# EAGLE schematic 7219_32_16 (EAGLE 7.7.0)

## Sheet 1 of 4
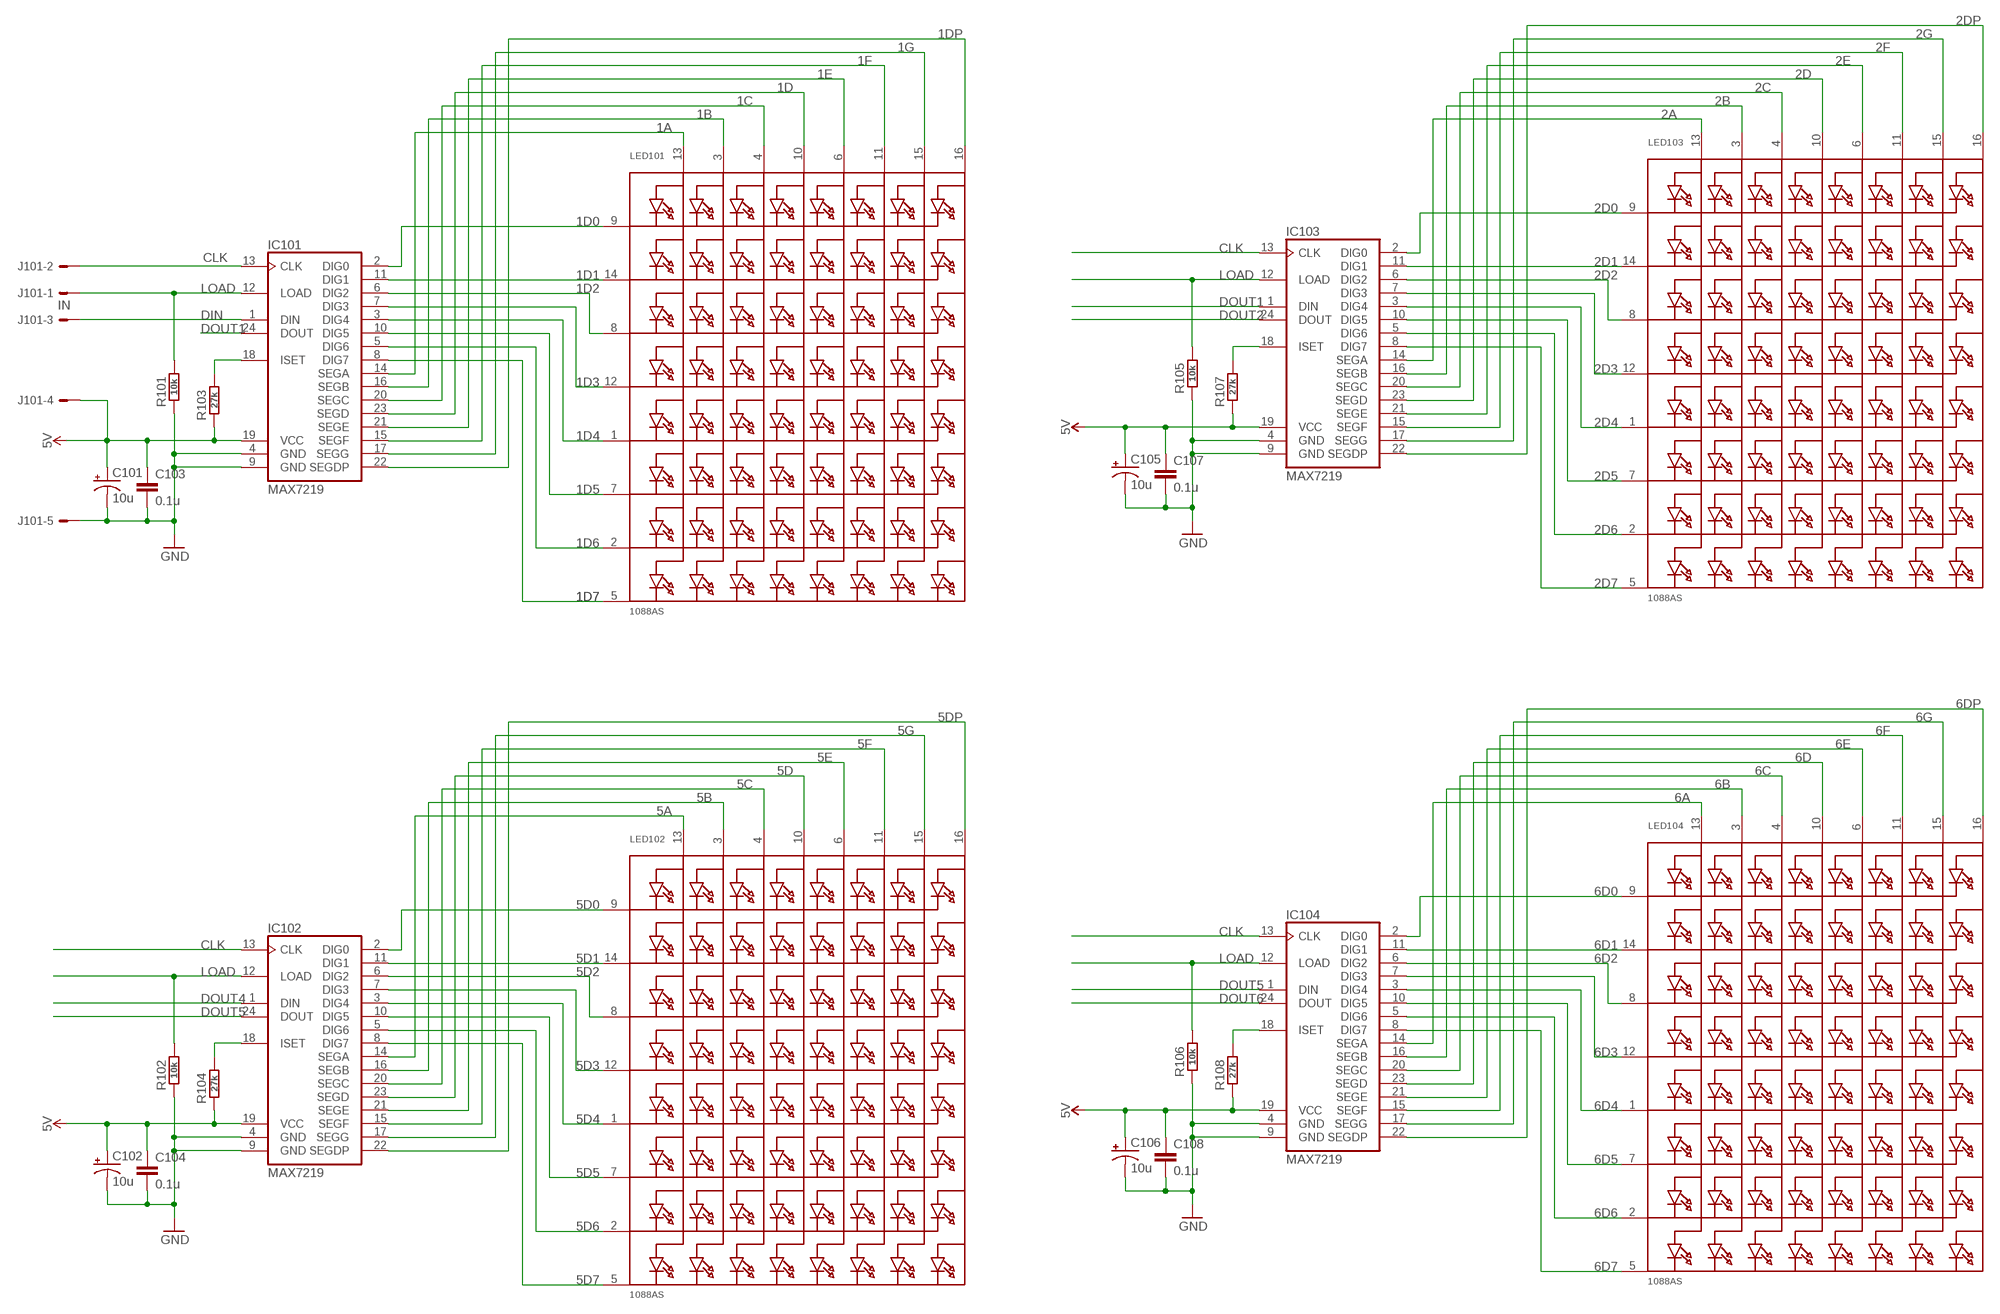
[diagram p0: schematic, sheet 1, part 1 of 2]
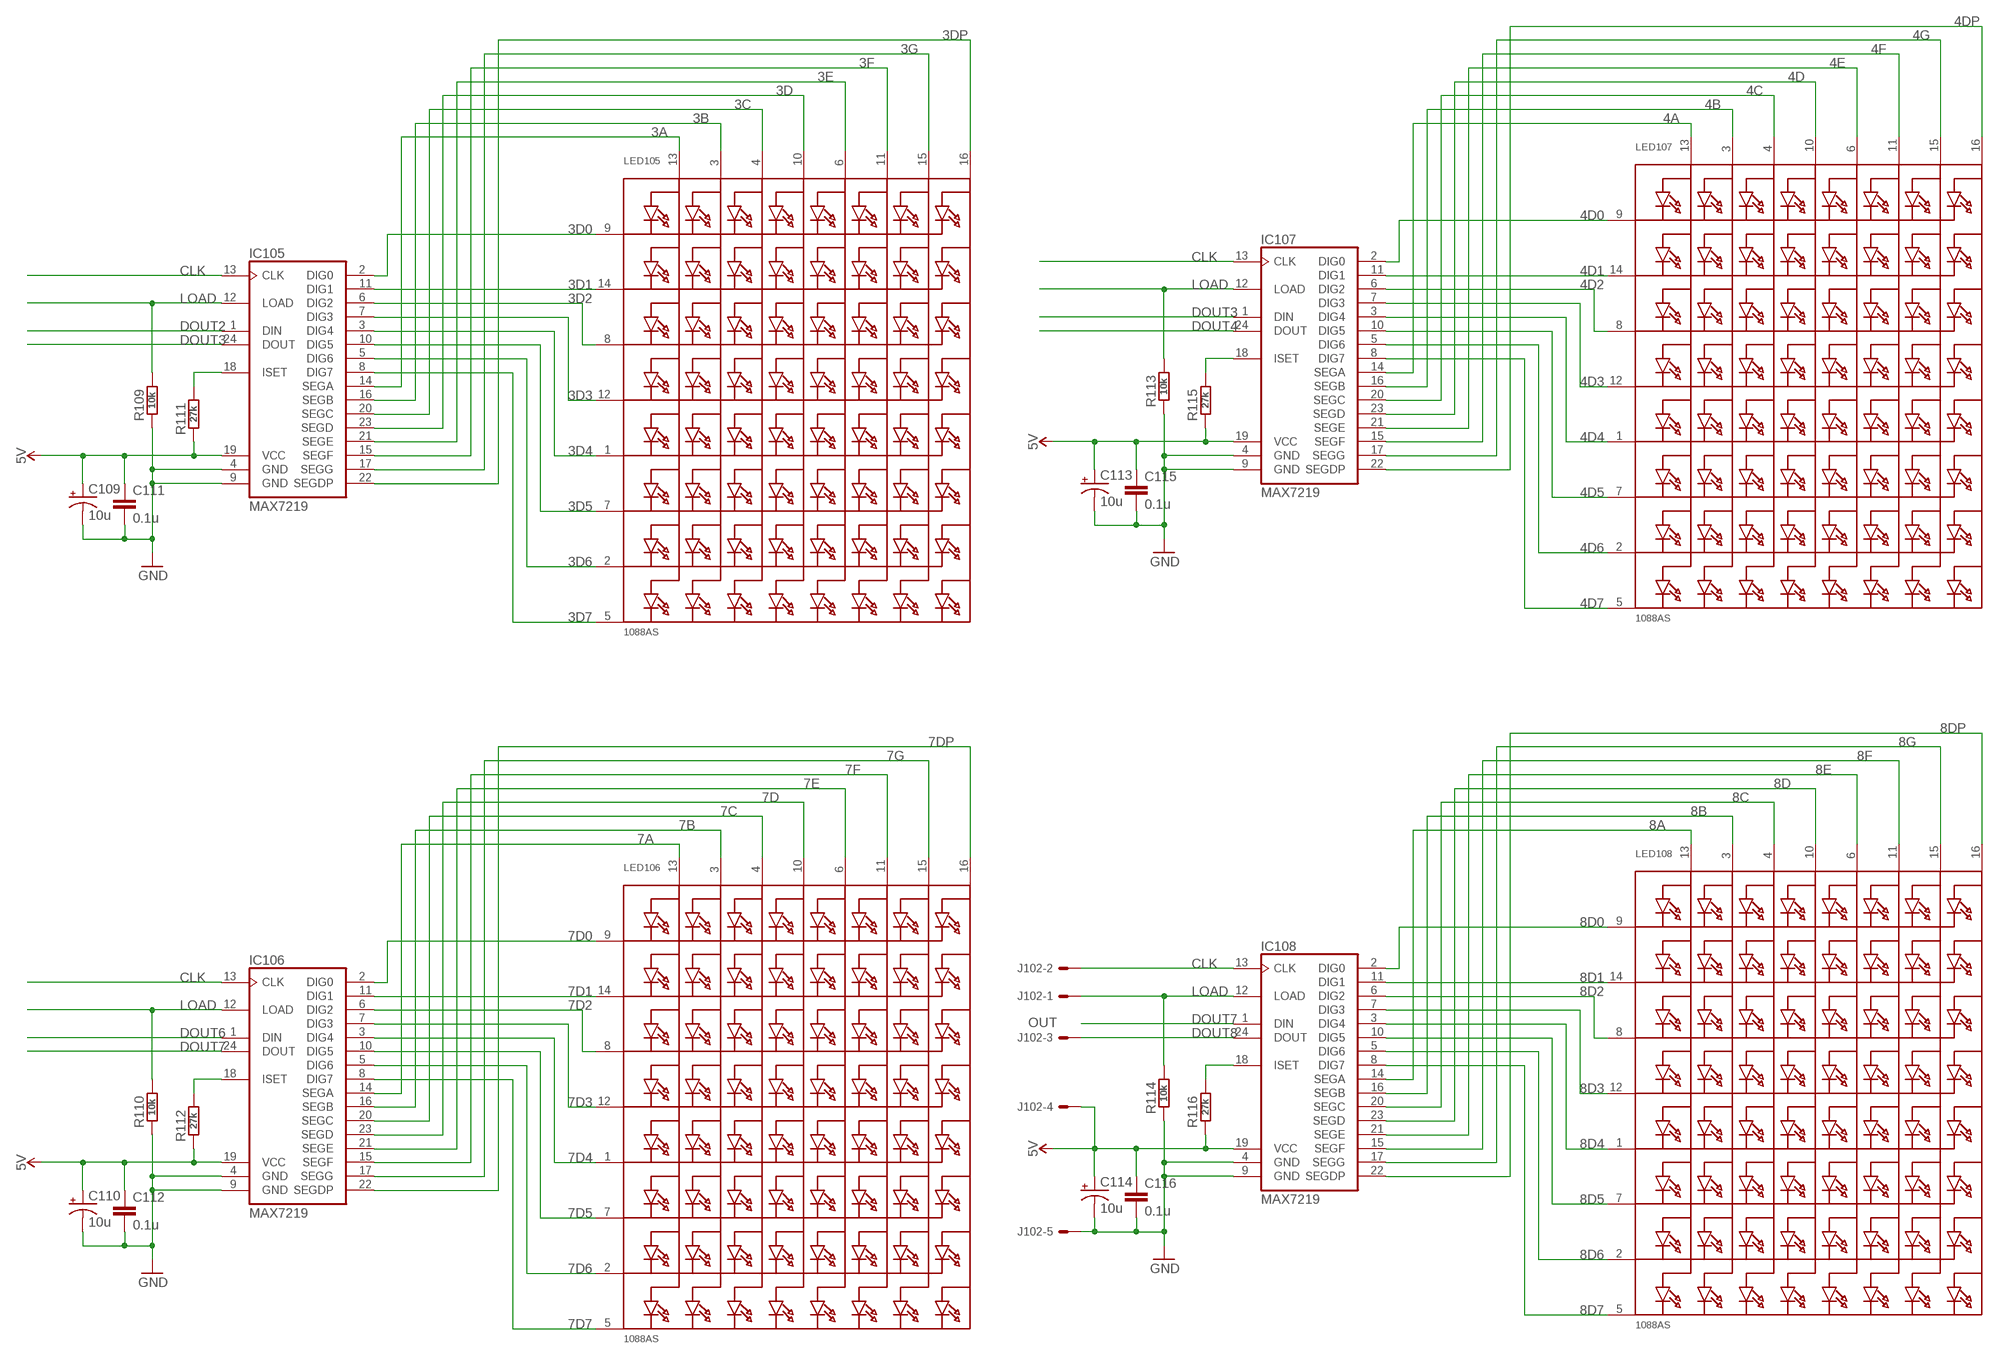
[diagram p1: schematic, sheet 1, part 2 of 2]

### Parts
C101  10u  CAP_POL1206  [EIA3216]
C102  10u  CAP_POL1206  [EIA3216]
C103  0.1u  CAP0603-CAP  [0603-CAP]
C104  0.1u  CAP0603-CAP  [0603-CAP]
C105  10u  CAP_POL1206  [EIA3216]
C106  10u  CAP_POL1206  [EIA3216]
C107  0.1u  CAP0603-CAP  [0603-CAP]
C108  0.1u  CAP0603-CAP  [0603-CAP]
C109  10u  CAP_POL1206  [EIA3216]
C110  10u  CAP_POL1206  [EIA3216]
C111  0.1u  CAP0603-CAP  [0603-CAP]
C112  0.1u  CAP0603-CAP  [0603-CAP]
C113  10u  CAP_POL1206  [EIA3216]
C114  10u  CAP_POL1206  [EIA3216]
C115  0.1u  CAP0603-CAP  [0603-CAP]
C116  0.1u  CAP0603-CAP  [0603-CAP]
IC101  MAX7219  MAX7219CNGSO24  [SO24L]
IC102  MAX7219  MAX7219CNGSO24  [SO24L]
IC103  MAX7219  MAX7219CNGSO24  [SO24L]
IC104  MAX7219  MAX7219CNGSO24  [SO24L]
IC105  MAX7219  MAX7219CNGSO24  [SO24L]
IC106  MAX7219  MAX7219CNGSO24  [SO24L]
IC107  MAX7219  MAX7219CNGSO24  [SO24L]
IC108  MAX7219  MAX7219CNGSO24  [SO24L]
J101  IN  C-GRID-05-70543  [70543-05]
J102  OUT  C-GRID-05-70543  [70543-05]
LED101  1088AS  DISP_SEGMENT_8X8_ROWCATHODEM12A881UR  [SEGMENT_BL-M12A881UR]
LED102  1088AS  DISP_SEGMENT_8X8_ROWCATHODEM12A881UR  [SEGMENT_BL-M12A881UR]
LED103  1088AS  DISP_SEGMENT_8X8_ROWCATHODEM12A881UR  [SEGMENT_BL-M12A881UR]
LED104  1088AS  DISP_SEGMENT_8X8_ROWCATHODEM12A881UR  [SEGMENT_BL-M12A881UR]
LED105  1088AS  DISP_SEGMENT_8X8_ROWCATHODEM12A881UR  [SEGMENT_BL-M12A881UR]
LED106  1088AS  DISP_SEGMENT_8X8_ROWCATHODEM12A881UR  [SEGMENT_BL-M12A881UR]
LED107  1088AS  DISP_SEGMENT_8X8_ROWCATHODEM12A881UR  [SEGMENT_BL-M12A881UR]
LED108  1088AS  DISP_SEGMENT_8X8_ROWCATHODEM12A881UR  [SEGMENT_BL-M12A881UR]
R101  10k  R-EU_R0603  [R0603]
R102  10k  R-EU_R0603  [R0603]
R103  27k  R-EU_R0603  [R0603]
R104  27k  R-EU_R0603  [R0603]
R105  10k  R-EU_R0603  [R0603]
R106  10k  R-EU_R0603  [R0603]
R107  27k  R-EU_R0603  [R0603]
R108  27k  R-EU_R0603  [R0603]
R109  10k  R-EU_R0603  [R0603]
R110  10k  R-EU_R0603  [R0603]
R111  27k  R-EU_R0603  [R0603]
R112  27k  R-EU_R0603  [R0603]
R113  10k  R-EU_R0603  [R0603]
R114  10k  R-EU_R0603  [R0603]
R115  27k  R-EU_R0603  [R0603]
R116  27k  R-EU_R0603  [R0603]

### Nets
1A: IC101.14(SEGA) LED101.13(A1)
1B: IC101.16(SEGB) LED101.3(A2)
1C: IC101.20(SEGC) LED101.4(A3)
1D: IC101.23(SEGD) LED101.10(A4)
1D0: IC101.2(DIG0) LED101.9(K1)
1D1: IC101.11(DIG1) LED101.14(K2)
1D2: IC101.6(DIG2) LED101.8(K3)
1D3: IC101.7(DIG3) LED101.12(K4)
1D4: IC101.3(DIG4) LED101.1(K5)
1D5: IC101.10(DIG5) LED101.7(K6)
1D6: IC101.5(DIG6) LED101.2(K7)
1D7: IC101.8(DIG7) LED101.5(K8)
1DP: IC101.22(SEGDP) LED101.16(A8)
1E: IC101.21(SEGE) LED101.6(A5)
1F: IC101.15(SEGF) LED101.11(A6)
1G: IC101.17(SEGG) LED101.15(A7)
2A: IC103.14(SEGA) LED103.13(A1)
2B: IC103.16(SEGB) LED103.3(A2)
2C: IC103.20(SEGC) LED103.4(A3)
2D: IC103.23(SEGD) LED103.10(A4)
2D0: IC103.2(DIG0) LED103.9(K1)
2D1: IC103.11(DIG1) LED103.14(K2)
2D2: IC103.6(DIG2) LED103.8(K3)
2D3: IC103.7(DIG3) LED103.12(K4)
2D4: IC103.3(DIG4) LED103.1(K5)
2D5: IC103.10(DIG5) LED103.7(K6)
2D6: IC103.5(DIG6) LED103.2(K7)
2D7: IC103.8(DIG7) LED103.5(K8)
2DP: IC103.22(SEGDP) LED103.16(A8)
2E: IC103.21(SEGE) LED103.6(A5)
2F: IC103.15(SEGF) LED103.11(A6)
2G: IC103.17(SEGG) LED103.15(A7)
3A: IC105.14(SEGA) LED105.13(A1)
3B: IC105.16(SEGB) LED105.3(A2)
3C: IC105.20(SEGC) LED105.4(A3)
3D: IC105.23(SEGD) LED105.10(A4)
3D0: IC105.2(DIG0) LED105.9(K1)
3D1: IC105.11(DIG1) LED105.14(K2)
3D2: IC105.6(DIG2) LED105.8(K3)
3D3: IC105.7(DIG3) LED105.12(K4)
3D4: IC105.3(DIG4) LED105.1(K5)
3D5: IC105.10(DIG5) LED105.7(K6)
3D6: IC105.5(DIG6) LED105.2(K7)
3D7: IC105.8(DIG7) LED105.5(K8)
3DP: IC105.22(SEGDP) LED105.16(A8)
3E: IC105.21(SEGE) LED105.6(A5)
3F: IC105.15(SEGF) LED105.11(A6)
3G: IC105.17(SEGG) LED105.15(A7)
4A: IC107.14(SEGA) LED107.13(A1)
4B: IC107.16(SEGB) LED107.3(A2)
4C: IC107.20(SEGC) LED107.4(A3)
4D: IC107.23(SEGD) LED107.10(A4)
4D0: IC107.2(DIG0) LED107.9(K1)
4D1: IC107.11(DIG1) LED107.14(K2)
4D2: IC107.6(DIG2) LED107.8(K3)
4D3: IC107.7(DIG3) LED107.12(K4)
4D4: IC107.3(DIG4) LED107.1(K5)
4D5: IC107.10(DIG5) LED107.7(K6)
4D6: IC107.5(DIG6) LED107.2(K7)
4D7: IC107.8(DIG7) LED107.5(K8)
4DP: IC107.22(SEGDP) LED107.16(A8)
4E: IC107.21(SEGE) LED107.6(A5)
4F: IC107.15(SEGF) LED107.11(A6)
4G: IC107.17(SEGG) LED107.15(A7)
5A: IC102.14(SEGA) LED102.13(A1)
5B: IC102.16(SEGB) LED102.3(A2)
5C: IC102.20(SEGC) LED102.4(A3)
5D: IC102.23(SEGD) LED102.10(A4)
5D0: IC102.2(DIG0) LED102.9(K1)
5D1: IC102.11(DIG1) LED102.14(K2)
5D2: IC102.6(DIG2) LED102.8(K3)
5D3: IC102.7(DIG3) LED102.12(K4)
5D4: IC102.3(DIG4) LED102.1(K5)
5D5: IC102.10(DIG5) LED102.7(K6)
5D6: IC102.5(DIG6) LED102.2(K7)
5D7: IC102.8(DIG7) LED102.5(K8)
5DP: IC102.22(SEGDP) LED102.16(A8)
5E: IC102.21(SEGE) LED102.6(A5)
5F: IC102.15(SEGF) LED102.11(A6)
5G: IC102.17(SEGG) LED102.15(A7)
6A: IC104.14(SEGA) LED104.13(A1)
6B: IC104.16(SEGB) LED104.3(A2)
6C: IC104.20(SEGC) LED104.4(A3)
6D: IC104.23(SEGD) LED104.10(A4)
6D0: IC104.2(DIG0) LED104.9(K1)
6D1: IC104.11(DIG1) LED104.14(K2)
6D2: IC104.6(DIG2) LED104.8(K3)
6D3: IC104.7(DIG3) LED104.12(K4)
6D4: IC104.3(DIG4) LED104.1(K5)
6D5: IC104.10(DIG5) LED104.7(K6)
6D6: IC104.5(DIG6) LED104.2(K7)
6D7: IC104.8(DIG7) LED104.5(K8)
6DP: IC104.22(SEGDP) LED104.16(A8)
6E: IC104.21(SEGE) LED104.6(A5)
6F: IC104.15(SEGF) LED104.11(A6)
6G: IC104.17(SEGG) LED104.15(A7)
7A: IC106.14(SEGA) LED106.13(A1)
7B: IC106.16(SEGB) LED106.3(A2)
7C: IC106.20(SEGC) LED106.4(A3)
7D: IC106.23(SEGD) LED106.10(A4)
7D0: IC106.2(DIG0) LED106.9(K1)
7D1: IC106.11(DIG1) LED106.14(K2)
7D2: IC106.6(DIG2) LED106.8(K3)
7D3: IC106.7(DIG3) LED106.12(K4)
7D4: IC106.3(DIG4) LED106.1(K5)
7D5: IC106.10(DIG5) LED106.7(K6)
7D6: IC106.5(DIG6) LED106.2(K7)
7D7: IC106.8(DIG7) LED106.5(K8)
7DP: IC106.22(SEGDP) LED106.16(A8)
7E: IC106.21(SEGE) LED106.6(A5)
7F: IC106.15(SEGF) LED106.11(A6)
7G: IC106.17(SEGG) LED106.15(A7)
8A: IC108.14(SEGA) LED108.13(A1)
8B: IC108.16(SEGB) LED108.3(A2)
8C: IC108.20(SEGC) LED108.4(A3)
8D: IC108.23(SEGD) LED108.10(A4)
8D0: IC108.2(DIG0) LED108.9(K1)
8D1: IC108.11(DIG1) LED108.14(K2)
8D2: IC108.6(DIG2) LED108.8(K3)
8D3: IC108.7(DIG3) LED108.12(K4)
8D4: IC108.3(DIG4) LED108.1(K5)
8D5: IC108.10(DIG5) LED108.7(K6)
8D6: IC108.5(DIG6) LED108.2(K7)
8D7: IC108.8(DIG7) LED108.5(K8)
8DP: IC108.22(SEGDP) LED108.16(A8)
8E: IC108.21(SEGE) LED108.6(A5)
8F: IC108.15(SEGF) LED108.11(A6)
8G: IC108.17(SEGG) LED108.15(A7)
+5V: C101.A(+) C102.A(+) C103.1 C104.1 C105.A(+) C106.A(+) C107.1 C108.1 C109.A(+) C110.A(+) C111.1 C112.1 C113.A(+) C114.A(+) C115.1 C116.1 IC101.19(VCC) IC102.19(VCC) IC103.19(VCC) IC104.19(VCC) IC105.19(VCC) IC106.19(VCC) IC107.19(VCC) IC108.19(VCC) J101.4 J102.4 R103.1 R104.1 R107.1 R108.1 R111.1 R112.1 R115.1 R116.1 ; supply symbol labelled 5V ; also sheet 2
CLK: IC101.13(CLK) IC102.13(CLK) IC103.13(CLK) IC104.13(CLK) IC105.13(CLK) IC106.13(CLK) IC107.13(CLK) IC108.13(CLK) J101.2 J102.2 ; also sheet 2,3
DIN: IC101.1(DIN) J101.3 ; also sheet 2,3
DOUT1: IC101.24(DOUT) IC103.1(DIN)
DOUT2: IC103.24(DOUT) IC105.1(DIN)
DOUT3: IC105.24(DOUT) IC107.1(DIN)
DOUT4: IC102.1(DIN) IC107.24(DOUT)
DOUT5: IC102.24(DOUT) IC104.1(DIN)
DOUT6: IC104.24(DOUT) IC106.1(DIN)
DOUT7: IC106.24(DOUT) IC108.1(DIN)
DOUT8: IC108.24(DOUT) J102.3
GND: C101.C(-) C102.C(-) C103.2 C104.2 C105.C(-) C106.C(-) C107.2 C108.2 C109.C(-) C110.C(-) C111.2 C112.2 C113.C(-) C114.C(-) C115.2 C116.2 IC101.4(GND) IC101.9(GND) IC102.4(GND) IC102.9(GND) IC103.4(GND) IC103.9(GND) IC104.4(GND) IC104.9(GND) IC105.4(GND) IC105.9(GND) IC106.4(GND) IC106.9(GND) IC107.4(GND) IC107.9(GND) IC108.4(GND) IC108.9(GND) J101.5 J102.5 R101.1 R102.1 R105.1 R106.1 R109.1 R110.1 R113.1 R114.1 ; also sheet 2,3,4
ISET1: IC101.18(ISET) R103.2
ISET2: IC103.18(ISET) R107.2
ISET3: IC105.18(ISET) R111.2
ISET4: IC107.18(ISET) R115.2
ISET5: IC102.18(ISET) R104.2
ISET6: IC104.18(ISET) R108.2
ISET7: IC106.18(ISET) R112.2
ISET8: IC108.18(ISET) R116.2
LOAD: IC101.12(LOAD) IC102.12(LOAD) IC103.12(LOAD) IC104.12(LOAD) IC105.12(LOAD) IC106.12(LOAD) IC107.12(LOAD) IC108.12(LOAD) J101.1 J102.1 R101.2 R102.2 R105.2 R106.2 R109.2 R110.2 R113.2 R114.2 ; also sheet 2,3

## Sheet 2 of 4
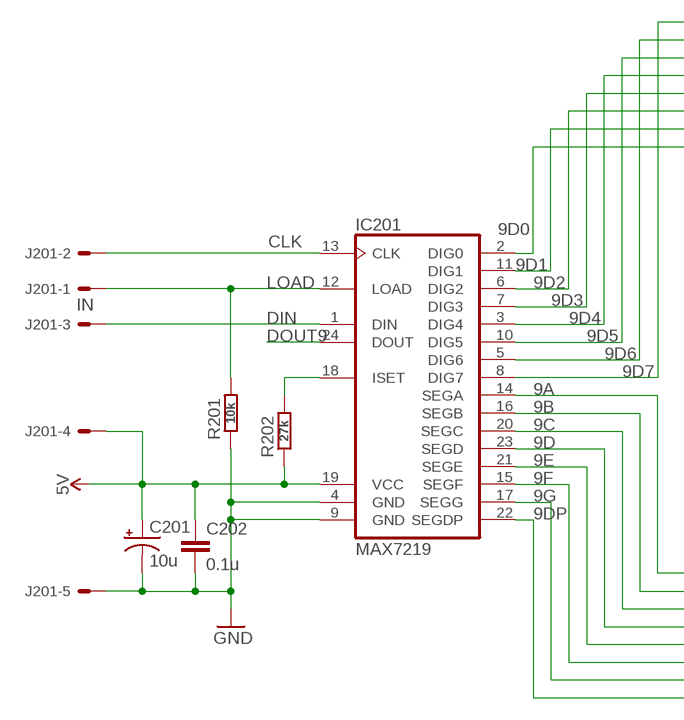
[diagram p2: schematic, sheet 2, part 1 of 2]
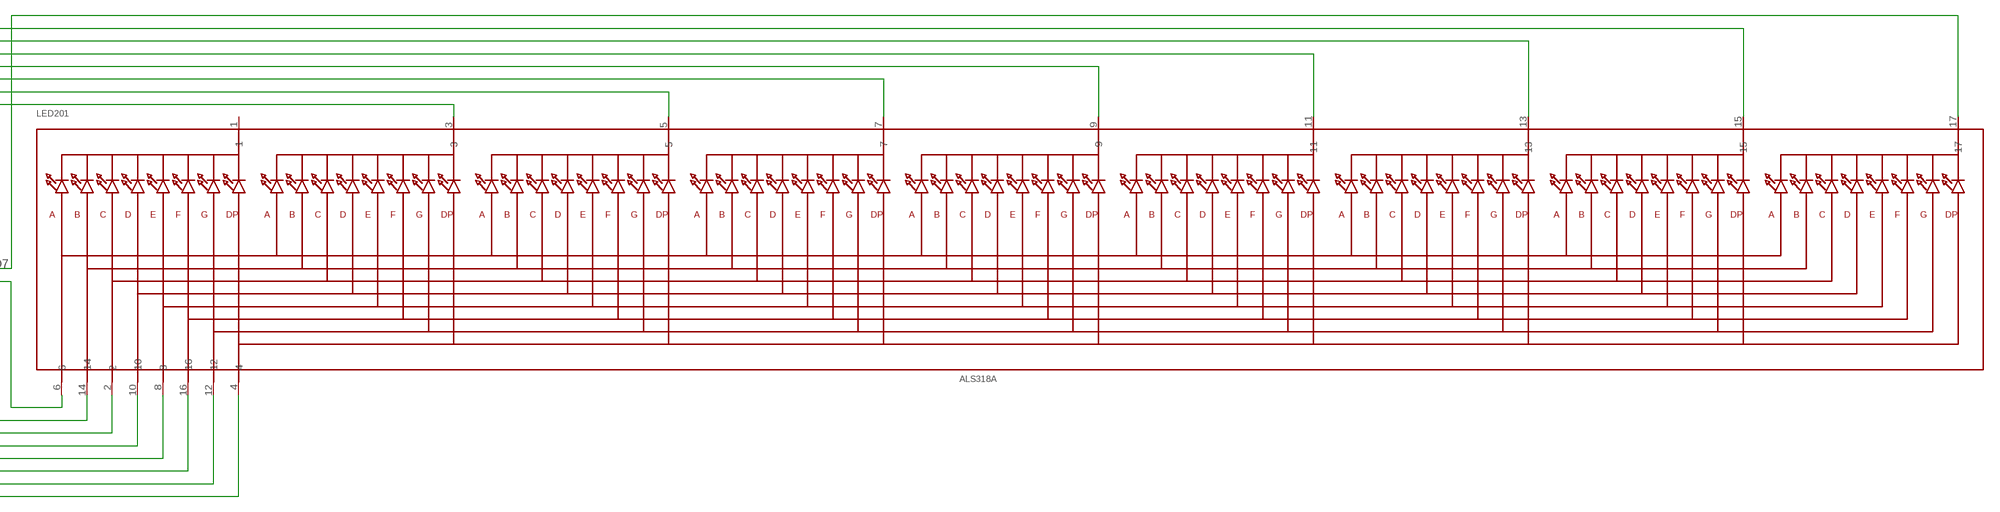
[diagram p3: schematic, sheet 2, part 2 of 2]

### Parts
C201  10u  CAP_POL1206  [EIA3216]
C202  0.1u  CAP0603-CAP  [0603-CAP]
IC201  MAX7219  MAX7219CNGSO24  [SO24L]
J201  IN  C-GRID-05-70543  [70543-05]
LED201  ALS318A  АЛС318АBASE  [АЛС318А]
R201  10k  R-EU_R0603  [R0603]
R202  27k  R-EU_R0603  [R0603]

### Nets
9A: IC201.14(SEGA) LED201.6
9B: IC201.16(SEGB) LED201.14
9C: IC201.20(SEGC) LED201.2
9D: IC201.23(SEGD) LED201.10
9D0: IC201.2(DIG0) LED201.3
9D1: IC201.11(DIG1) LED201.5
9D2: IC201.6(DIG2) LED201.7
9D3: IC201.7(DIG3) LED201.9
9D4: IC201.3(DIG4) LED201.11
9D5: IC201.10(DIG5) LED201.13
9D6: IC201.5(DIG6) LED201.15
9D7: IC201.8(DIG7) LED201.17
9DP: IC201.22(SEGDP) LED201.4
9E: IC201.21(SEGE) LED201.8
9F: IC201.15(SEGF) LED201.16
9G: IC201.17(SEGG) LED201.12
+5V: C201.A(+) C202.1 IC201.19(VCC) J201.4 R202.1 ; supply symbol labelled 5V ; also sheet 1
CLK: IC201.13(CLK) J201.2 ; also sheet 1,3
DIN: IC201.1(DIN) J201.3 ; also sheet 1,3
DOUT9: IC201.24(DOUT)
GND: C201.C(-) C202.2 IC201.4(GND) IC201.9(GND) J201.5 R201.1 ; also sheet 1,3,4
ISET9: IC201.18(ISET) R202.2
LOAD: IC201.12(LOAD) J201.1 R201.2 ; also sheet 1,3
Unconnected: LED201.1

## Sheet 3 of 4
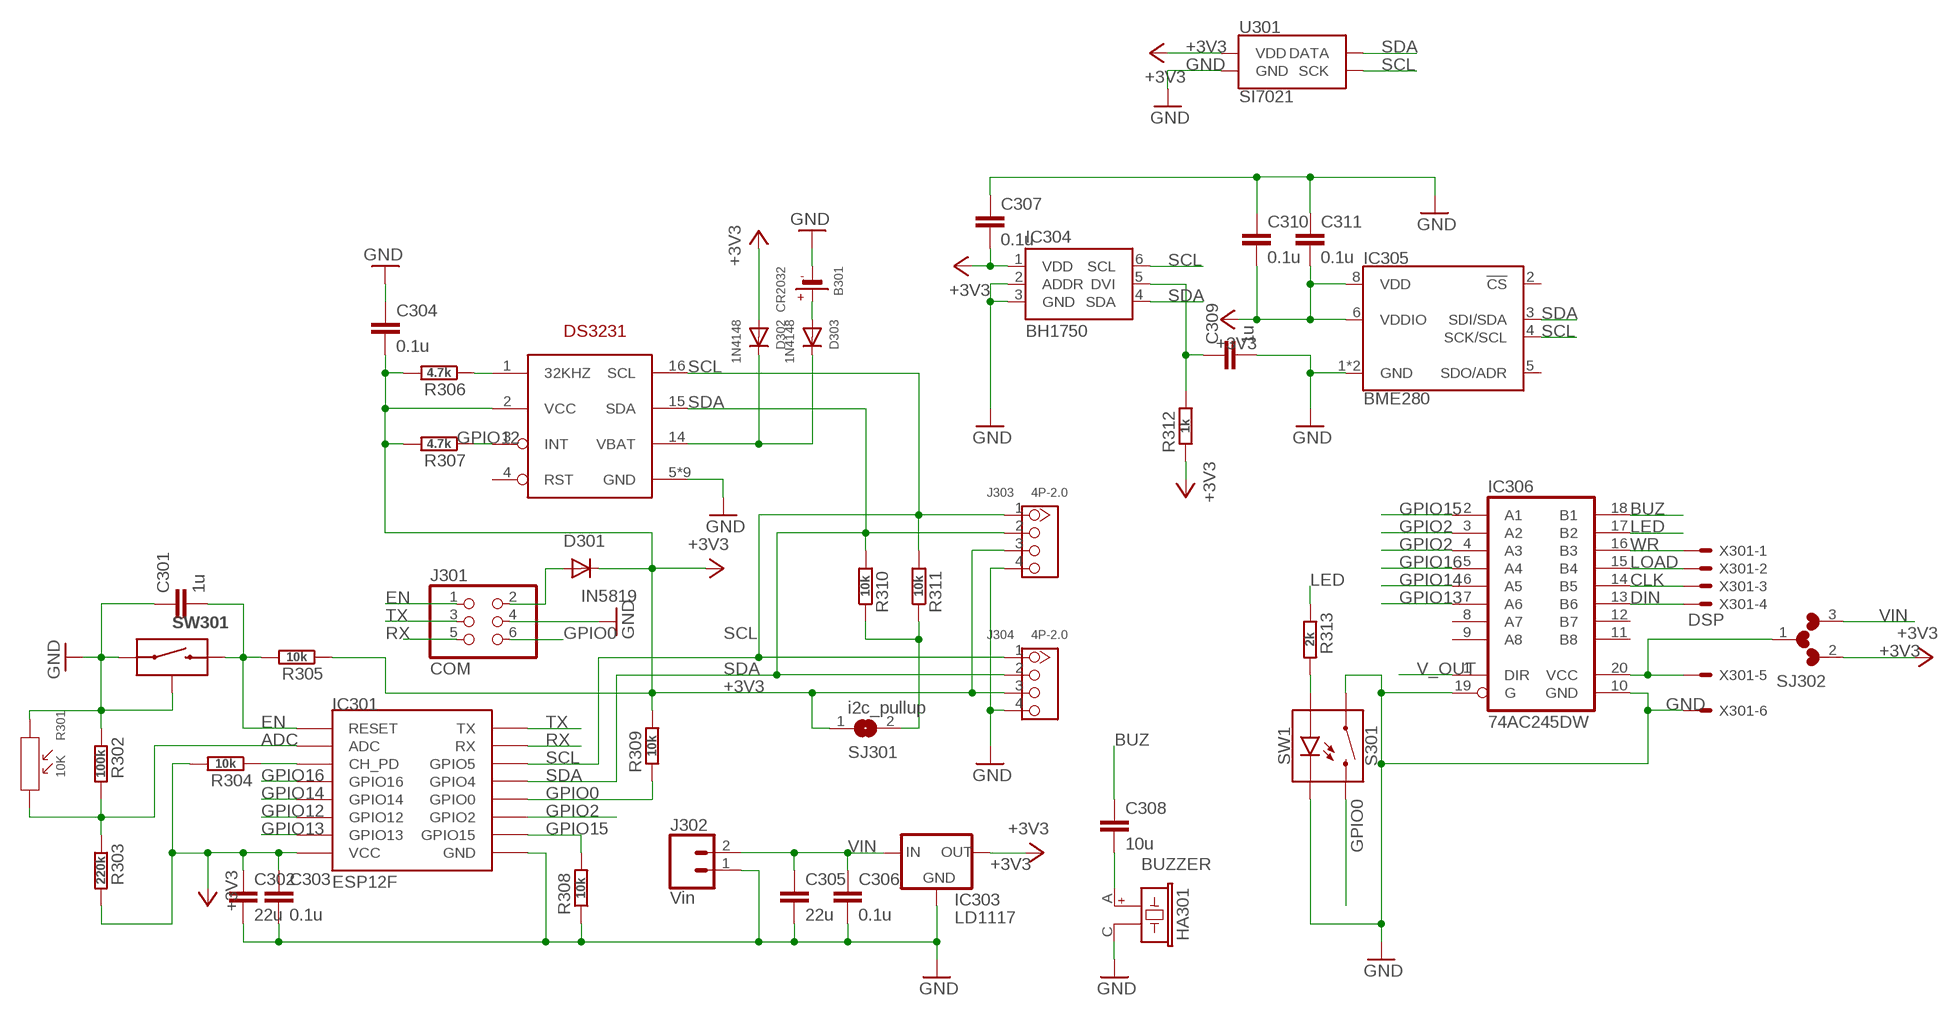
[diagram p4: schematic, sheet 3]

### Parts
B301  CR2032  BATTERYCR2032  [CR2032]
C301  1u  CAP0603-CAP  [0603-CAP]
C302  22u  CAP0603-CAP  [0603-CAP]
C303  0.1u  CAP0603-CAP  [0603-CAP]
C304  0.1u  CAP0603-CAP  [0603-CAP]
C305  22u  CAP0603-CAP  [0603-CAP]
C306  0.1u  CAP0603-CAP  [0603-CAP]
C307  0.1u  CAP0603-CAP  [0603-CAP]
C308  10u  CAP0603-CAP  [0603-CAP]
C309  1u  CAP0603-CAP  [0603-CAP]
C310  0.1u  CAP0603-CAP  [0603-CAP]
C311  0.1u  CAP0603-CAP  [0603-CAP]
D301  IN5819  DIODE-SOD123  [SOD123]
D302  1N4148  DIODESOD-323F  [SOD-323F]
D303  1N4148  DIODESOD-323F  [SOD-323F]
HA301  BUZZER  PIEZO_BUZZERHYDZ12X7.5  [PBUZ_12X7.5]
IC301  ESP12F  ESP12SMD  [ESP12-SMD]
IC302  DS3231W  [SO16W]
IC303  LD1117  V_REG_LD1117VXXSMD  [SOT223]
IC304  BH1750  [WSOF6L]
IC305  BME280  [LGA-8-2.5X2.5]
IC306  74AC245DW  [SO20W]
J301  COM  HEADER-2X3SMT_1.27  [2X03_1.27MM_SMT]
J302  Vin  CONN_02  [1X02]
J303  4P-2.0  GROVE-CONNECTOR-DIP(4P-2.0)  [HW4-2.0]
J304  4P-2.0  GROVE-CONNECTOR-DIP(4P-2.0)  [HW4-2.0]
R301  10K  PHOTORESISTOR-5528-10K(2P-5.0X4.2MM)  [SNR2-3.0]
R302  100k  R-EU_R0603  [R0603]
R303  220k  R-EU_R0603  [R0603]
R304  10k  R-EU_R0603  [R0603]
R305  10k  R-EU_R0603  [R0603]
R306  4.7k  R-EU_R0603  [R0603]
R307  4.7k  R-EU_R0603  [R0603]
R308  10k  R-EU_R0603  [R0603]
R309  10k  R-EU_R0603  [R0603]
R310  10k  R-EU_R0603  [R0603]
R311  10k  R-EU_R0603  [R0603]
R312  1k  R-EU_R0603  [R0603]
R313  2k  R-EU_R0603  [R0603]
S301  SW1  MOMENTARY-SWITCH-SPST-LED-PTH-12MM-KIT  [TACTILE_SWITCH_LED_PTH_12MM_KIT]
SJ301  i2c_pullup  MICROBUILDER_SOLDERJUMPER  [MICROBUILDER_SOLDERJUMPER_ARROW_NOPASTE]
SJ302  MICROBUILDER_SOLDERJUMPER3  [MICROBUILDER_SOLDERJUMPER_ARROW_NOPASTE_3]
SW301  RST  MICROSWITCH-BUTTON  [MICROPUSH-BUT_TOP]
U301  SI7021  [DFN-6-3X3-SI7021]
X301  DSP  C-GRID-06-70543  [70543-06]

### Nets
+3V3: C302.1 C303.1 C304.2 C307.2 C310.2 C311.2 D301.C D302.A IC301.VCC IC302.2(VCC) IC303.2(OUT) IC303.4(OUT) IC304.1(VDD) IC305.6(VDDIO) IC305.8(VDD) J303.3 J304.3 R303.2 R304.2 R305.1 R306.2 R307.2 R309.2 R312.1 SJ301.1 SJ302.2 U301.VDD ; also sheet 4
ADC: IC301.ADC R301.2 R302.2 R303.1
BUZ: C308.1 IC306.18(B1)
CLK: IC306.14(B5) X301.3 ; also sheet 1,2
DIN: IC306.13(B6) X301.4 ; also sheet 1,2
EN: C301.2 IC301.RESET J301.1 R305.2 SW301.B ; also sheet 4
GND: B301.- C301.1 C302.2 C303.2 C304.1 C305.2 C306.2 C307.1 C309.2 C310.1 C311.1 HA301.C IC301.GND IC302.5(GND) IC302.6(GND) IC302.7(GND) IC302.8(GND) IC302.9(GND) IC302.10(GND) IC302.11(GND) IC302.12(GND) IC302.13(GND) IC303.1(GND) IC304.2(ADDR) IC304.3(GND) IC305.1(GND) IC305.7(GND) IC306.10(GND) IC306.19(G) J301.4 J302.1 J303.4 J304.4 R301.1 R302.1 R308.1 S301.3 S301.4 S301.C SW301.A SW301.SH0(SH) U301.GND X301.6 ; also sheet 1,2,4
GPIO0: IC301.GPIO0 J301.6 R309.1 S301.1 S301.2 ; also sheet 4
GPIO2: IC301.GPIO2 IC306.3(A2) IC306.4(A3)
GPIO12: IC301.GPIO12 IC302.3(INT) R307.1
GPIO13: IC301.GPIO13 IC306.7(A6)
GPIO14: IC301.GPIO14 IC306.6(A5)
GPIO15: IC301.GPIO15 IC306.2(A1) R308.2
GPIO16: IC301.GPIO16 IC306.5(A4)
LED: IC306.17(B2) R313.1
LOAD: IC306.15(B4) X301.2 ; also sheet 1,2
N$1: D302.C D303.C IC302.14(VBAT)
N$5: R313.2 S301.A
N$16: IC301.CH_PD R304.1
N$22: C308.2 HA301.A
N$25: C309.1 IC304.5(DVI) R312.2
N$32: IC302.1(32KHZ) R306.1
N$39: R310.1 R311.1 SJ301.2
N$47: D301.A J301.2
N$52: B301.+ D303.A
RX: IC301.RXD0(RX) J301.5 ; also sheet 4
SCL: IC301.GPIO5 IC302.16(SCL) IC304.6(SCL) IC305.4(SCK/SCL) J303.1 J304.1 R311.2 U301.SCK
SDA: IC301.GPIO4 IC302.15(SDA) IC304.4(SDA) IC305.3(SDI/SDA) J303.2 J304.2 R310.2 U301.DATA
TX: IC301.TXD0(TX) J301.3 ; also sheet 4
V_OUT: IC306.1(DIR) IC306.20(VCC) SJ302.1 X301.5
VIN: C305.1 C306.1 IC303.3(IN) J302.2 SJ302.3
WR: IC306.16(B3) X301.1
Unconnected: IC302.4(RST) IC305.2(!CS) IC305.5(SDO/ADR) IC306.8(A7) IC306.9(A8) IC306.11(B8) IC306.12(B7)

## Sheet 4 of 4
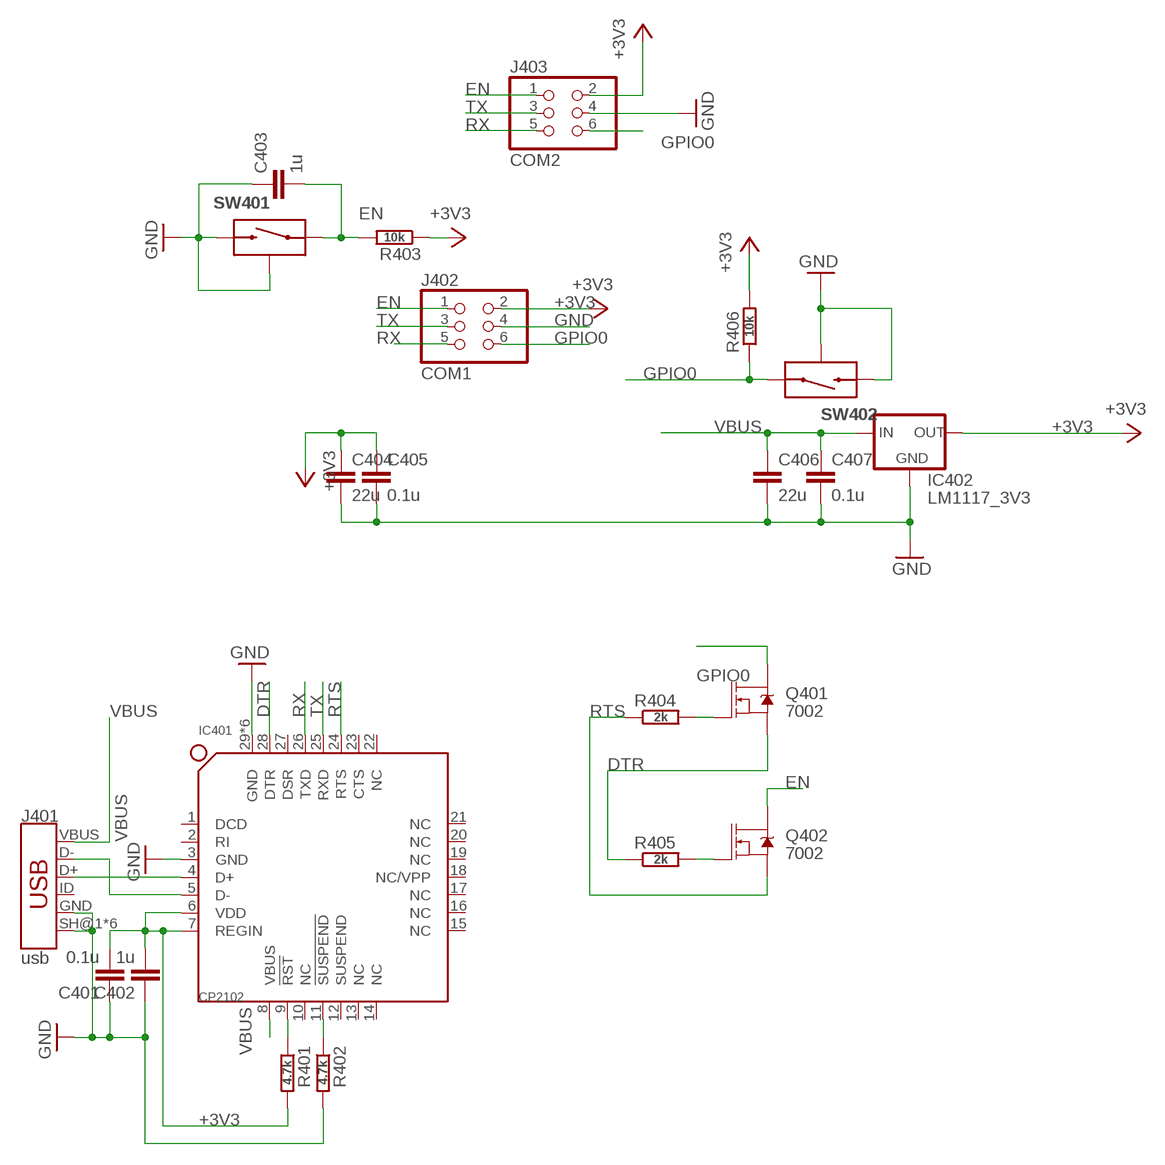
[diagram p5: schematic, sheet 4]

### Parts
C401  0.1u  CAP0603-CAP  [0603-CAP]
C402  1u  CAP0603-CAP  [0603-CAP]
C403  1u  CAP0603-CAP  [0603-CAP]
C404  22u  CAP0603-CAP  [0603-CAP]
C405  0.1u  CAP0603-CAP  [0603-CAP]
C406  22u  CAP0603-CAP  [0603-CAP]
C407  0.1u  CAP0603-CAP  [0603-CAP]
IC401  CP2102  CP2102-GMR(QFN28)  [QFN28G_0.5-5X5MM]
IC402  LM1117_3V3  V_REG_LD1117VXXSMD  [SOT223]
J401  usb  USB_MICRO-BFEMALE_SMT_  [USB-B-MICRO-SMD_MY]
J402  COM1  HEADER-2X3SMT_1.27  [2X03_1.27MM_SMT]
J403  COM2  HEADER-2X3TH  [2X03]
Q401  7002  MOSFET-NCH-2N7002  [SOT23-3]
Q402  7002  MOSFET-NCH-2N7002  [SOT23-3]
R401  4.7k  R-EU_R0603  [R0603]
R402  4.7k  R-EU_R0603  [R0603]
R403  10k  R-EU_R0603  [R0603]
R404  2k  R-EU_R0603  [R0603]
R405  2k  R-EU_R0603  [R0603]
R406  10k  R-EU_R0603  [R0603]
SW401  RST  MICROSWITCH-BUTTON  [MICROPUSH-BUT_TOP]
SW402  PRG  MICROSWITCH-BUTTON  [MICROPUSH-BUT_TOP]

### Nets
+3V3: C401.2 C402.2 C404.1 C405.1 IC401.6(VDD) IC401.7(REGIN) IC402.2(OUT) IC402.4(OUT) J402.2 J403.2 R401.2 R403.1 R406.2 ; also sheet 3
DTR: IC401.28(DTR) Q401.2(S) R405.1
EN: C403.2 J402.1 J403.1 Q402.3(D) R403.2 SW401.A ; also sheet 3
GND: C401.1 C402.1 C403.1 C404.2 C405.2 C406.2 C407.2 IC401.3(GND) IC401.29(GND) IC401.HG1(GND) IC401.HG2(GND) IC401.HG3(GND) IC401.HG4(GND) IC401.HG5(GND) IC402.1(GND) J401.GND J401.SH@1(SHIELD) J401.SH@2(SHIELD) J401.SH@3(SHIELD) J401.SH@4(SHIELD) J401.SH@5(SHIELD) J401.SH@6(SHIELD) J402.4 J403.4 R402.2 SW401.B SW401.SH0(SH) SW402.B SW402.SH0(SH) ; also sheet 1,2,3
GPIO0: J402.6 J403.6 Q401.3(D) R406.1 SW402.A ; also sheet 3
N$9: IC401.4(D+) J401.D+
N$10: IC401.5(D-) J401.D-
N$18: Q401.1(G) R404.2
N$24: Q402.1(G) R405.2
N$33: IC401.11(!SUSPEND) R402.1
N$36: IC401.9(!RST) R401.1
RTS: IC401.24(RTS) Q402.2(S) R404.1
RX: IC401.26(TXD) J402.5 J403.5 ; also sheet 3
TX: IC401.25(RXD) J402.3 J403.3 ; also sheet 3
VBUS: C406.1 C407.1 IC401.8(VBUS) IC402.3(IN) J401.VBUS
Unconnected: IC401.1(DCD) IC401.2(RI) IC401.10(NC) IC401.12(SUSPEND) IC401.13(NC) IC401.14(NC) IC401.15(NC) IC401.16(NC) IC401.17(NC) IC401.18(NC/VPP) IC401.19(NC) IC401.20(NC) IC401.21(NC) IC401.22(NC) IC401.23(CTS) IC401.27(DSR) J401.ID

## Library data of the parts
B301 = radiva5:BATTERY: CR1220 SMT - Digikey: 3001K-ND
C101 C102 C105 C106 C109 C110 C113 C114 C201 = radiva5:CAP_POL: Capacitor Polarized These are standard SMD and PTH capacitors. Normally 10uF, 47uF, and 100uF in electrolytic and tantalum varieties. Always verify the external diameter of the through hole cap, it varies with capacity, voltage, and manufacturer. The EIA devices should be standard.
C103 C104 C107 C108 C111 C112 C115 C116 C202 C301-C311 C401-C407 = radiva5:CAP: Capacitor Standard 0603 ceramic capacitor, and 0.1" leaded capacitor.
D301 = radiva5:DIODE-: DIODE
D302 D303 = clock02:DIODE: Diode SMADIODE - SMA Surface Mount Package 20V 1A Schottky Diode Digikey: 641-1014-6-ND DO-1N4148 - Through Hole Small Current Diode SOD-123 20V 1 A (.5mV Vf) Schottky Diode - Digikey: MBRX120TPMSCT-ND SOD-323 10V 570mA (.38mV Vf, 3ns) Schottky Diode - Digikey: ZLLS410CT-ND SOD-523 30V 30mA Schottky Diode (RB751S-40TE61) - Digikey: RB751S-40TE61CT-ND SOT23-R/W - SOT23 Package (R = Solder Paste/Reflow Ovens, W = Hand-Soldering) BAT54Film 40V 300mA - Digikey: 497-7162-1-ND
HA301 = radiva5:PIEZO_BUZZER: Generic Piezo Buzzer Package(s): 12 mm dia, 7.6 mm (Pitch)
IC101-IC108 IC201 = maxim:MAX7219CNG: LED DISPLAY DRIVER
IC301 = esp8266modules:ESP12: ESP8266 Wifi module 12
IC302 = radiva5:DS3231
IC303 IC402 = radiva5:V_REG_LD1117VXX: LD1117VXX voltage regulator. We carry the 3.3V version (COM-00526) in TO-220 package.; PROD_ID: VREG-13917
IC304 = radiva5:BH1750; PROD_ID: IC-13876; VALUE: ZOPT2201
IC305 = radiva5:BME280: Bosch BME280 – Combined Humidity and Pressure Sensor The BME280 is as combined digital humidity, pressure and temperature sensor based on proven sensing principles. The sensor module is housed in an extremely compact metal-lid LGA package with a footprint of only 2.5×2.5mm² with a height of 0.93mm. Its small dimensions and its low power consumption allow the implementation in battery driven devices such as handsets, GPS modules or watches. Datasheet <https://cdn.sparkfun.com/assets/learn_tutorials/4/1/9/BST-BME280_DS001-10.pdf> SparkFun Products SparkFun Atmospheric Sensor Breakout - BME280 <https://www.sparkfun.com/products/13676> (SEN-13676); PROD_ID: IC-13090
IC306 = 74xx-eu:74*245: Octal BUS TRANSCEIVER, 3-state
IC401 = radiva5:CP2102-GMR(QFN28): 310070003; MPN: CP2102-GMR; VALUE: CP2102-GMR-QFN28
J101 J102 J201 = con-molex:C-GRID-05: CONNECTOR wire to board 2.54 mm (0.100") pitch header; OC_FARNELL: unknown; OC_NEWARK: unknown
J301 J402 J403 = radiva5:HEADER-2X3: PIN HEADER
J302 = radiva5:CONN_02: Multi connection point. Often used as Generic Header-pin footprint for 0.1 inch spaced/style header connections On any of the 0.1 inch spaced packages, you can populate with these: Break Away Headers - Straight <https://www.sparkfun.com/products/116> (PRT-00116) Break Away Male Headers - Right Angle <https://www.sparkfun.com/products/553> (PRT-00553) Female Headers <https://www.sparkfun.com/products/115> (PRT-00115) Break Away Headers - Machine Pin <https://www.sparkfun.com/products/117> (PRT-00117) Break Away Female Headers - Swiss Machine Pin <https://www.sparkfun.com/products/743> (PRT-00743) Stackable Header - 3 Pin (Female, 0.1") <https://www.sparkfun.com/products/13875> (PRT-13875) For SCREWTERMINALS and SPRING TERMINALS visit here: Screw Terimnals on SparkFun.com <https://www.sparkfun.com/search/results?term=Screw+Terminals> (5mm/3.5mm/2.54mm spacing) This device is also useful as a general connection point to wire up your design to another part of your project. Our various solder wires solder well into these plated through hole pads. Hook-Up Wire - Assortment (Stranded, 22 AWG) <https://www.sparkfun.com/products/11375> (PRT-11375) Hook-Up Wire - Assortment (Solid Core, 22 AWG) <https://www.sparkfun.com/products/11367> (PRT-11367) View the entire wire category on our website here <https://www.sparkfun.com/categories/141> Special notes: Molex polarized connector foot print use with SKU : PRT-08232 with associated crimp pins and housings.
J303 J304 = radiva5:GROVE-CONNECTOR-DIP(4P-2.0): 320110033
J401 = radiva5:USB_MICRO-B: USB Type Micro-B Connector Male/female and PTH/SMT variants SparkFun Products: SparkFun microB USB Breakout <?https://www.sparkfun.com/products/12035?> SparkFun USB microB Plug Breakout <?https://www.sparkfun.com/products/10031?> SparkFun ESP8266 Thing <?https://www.sparkfun.com/products/13231?>
LED101-LED108 = microbuilder:DISP_SEGMENT_8X8_ROWCATHODE: 8x8 LED Segment Displays: Row = Cathode 0.7" Red 8X8 Matrix, 1.9mm Round LEDs - BL-M07C881UR 1.2" Red 8x8 Matrix, 3.0mm Round LEDs - BL-M12A881UR 1.2" Red 8x8 Matrix, 3.0mm Square LEDs - BL-M12A883
LED201 = radiva5:АЛС318А: 2 x Starburst Segment Displays - Common Cathode Luckylight KWA-541CBB
Q401 Q402 = radiva5:MOSFET-NCH: N-channel MOSFETs Voltage controlled devices that allow control of high current outputs. SparkFun Products: SparkFun OpenScale <?https://www.sparkfun.com/products/13261?> SparkFun Digital Sandbox <?https://www.sparkfun.com/products/12651?> SparkFun Monster Moto Shield <?https://www.sparkfun.com/products/10182?> SparkFun MOSFET Power Controller <?https://www.sparkfun.com/products/11214?>
R101-R116 R201 R202 R302-R313 R401-R406 = radiva5:R-EU_: RESISTOR, European symbol
R301 = radiva5:PHOTORESISTOR-5528-10K(2P-5.0X4.2MM): 314020017; MPN: PHOTORESISTOR-5528-10K; VALUE: PHOTORESISTOR-5528-10K
S301 = radiva5:MOMENTARY-SWITCH-SPST-LED: Momentary Switch (Pushbutton) - SPST - w/ LED Normally-open (NO) SPST momentary switches (buttons, pushbuttons), with a built-in LED. Variants PTH-CHERRY - Cherry MX Switch Cherry MX Keyswitches are top-of-the-line mechanical keyboard switches. Theyre satisfyingly clicky, reliable up to tens-of-millions of key presses, and a standard in gaming and programming keyboards across the globe. This blue version Cherry MX Switch is favored by most due to its secondary internal actuator making it less likely to double-tap. If you are looking for a noticeably audible and high-quality key switch, this is the perfect option for you! Cherry MX Switch <https://www.sparkfun.com/products/13834> (COM-13834) Cherry MX Switch Breakout <https://www.sparkfun.com/products/13773> (BOB-13773) PTH-12MM and PTH-12MM-KIT - 12mm Illuminated LED KIT variant is for soldering kits. There is no tStop (covering up the top side of the pads with mask). This helps the beginner see which side they should be soldering too. LED Tactile Button Breakout <https://www.sparkfun.com/products/10467> (BOB-10467) LED Tactile Button - Red <https://www.sparkfun.com/products/10442> (COM-10442) LED Tactile Button - Blue <https://www.sparkfun.com/products/10443> (COM-10443) LED Tactile Button - Green <https://www.sparkfun.com/products/10440> (COM-10440) LED Tactile Button - Orange <https://www.sparkfun.com/products/10441> (COM-10441) LED Tactile Button - White <https://www.sparkfun.com/products/10439> (COM-10439); PROD_ID: SWCH-11758; SF_SKU: COM-10442
SJ301 = radiva5:MICROBUILDER_SOLDERJUMPER: SMD Solder JUMPER Solder the two pads together to create a connection, or remove the solder to break it. REFLOW - Use this footprint for solder paste and reflow ovens. WAVE - Use this footprint for hand-soldering (larger pads). CLOSED - Has a trace between the two pads to ensure it is closed by default. The trace needs to be cut to disable the jumper, and can be closed again by creating a solder bridge between the two pads.; BOM: EXCLUDE
SJ302 = radiva5:MICROBUILDER_SOLDERJUMPER3: SMD Solder JUMPER Solder the two pads together to create a connection, or remove the solder to break it. REFLOW - Use this footprint for solder paste and reflow ovens. WAVE - Use this footprint for hand-soldering (larger pads). CLOSED - Has a trace between the two pads to ensure it is closed by default. The trace needs to be cut to disable the jumper, and can be closed again by creating a solder bridge between the two pads.
SW301 SW401 SW402 = radiva5:MICROSWITCH-BUTTON
U301 = radiva5:SI7021: Silicon Labs Si7021 I2C Humidity and Temperature Sensor The Si7021 is a low-cost, easy-to-use, highly accurate, digital humidity and temperature sensor. This sensor is ideal for environmental sensing and data logging and perfect for build a weather stations or humidor control system. All you need are two lines for I2C communication, and you’ll have relative humidity readings and very accurate temperature readings as a bonus! Datasheet <https://cdn.sparkfun.com/datasheets/Sensors/Weather/Si7021.pdf> SparkFun Products SparkFun Humidity and Temperature Sensor Breakout - Si7021 <https://www.sparkfun.com/products/13763> (SEN-13763) SparkFun Blynk Board - ESP8266 <https://www.sparkfun.com/products/13794> (WRL-13794); PROD_ID: IC-13093
X301 = con-molex:C-GRID-06: CONNECTOR wire to board 2.54 mm (0.100") pitch header; OC_FARNELL: unknown; OC_NEWARK: unknown